# EAGLE design 8_CAN (EAGLE 9.3.0)
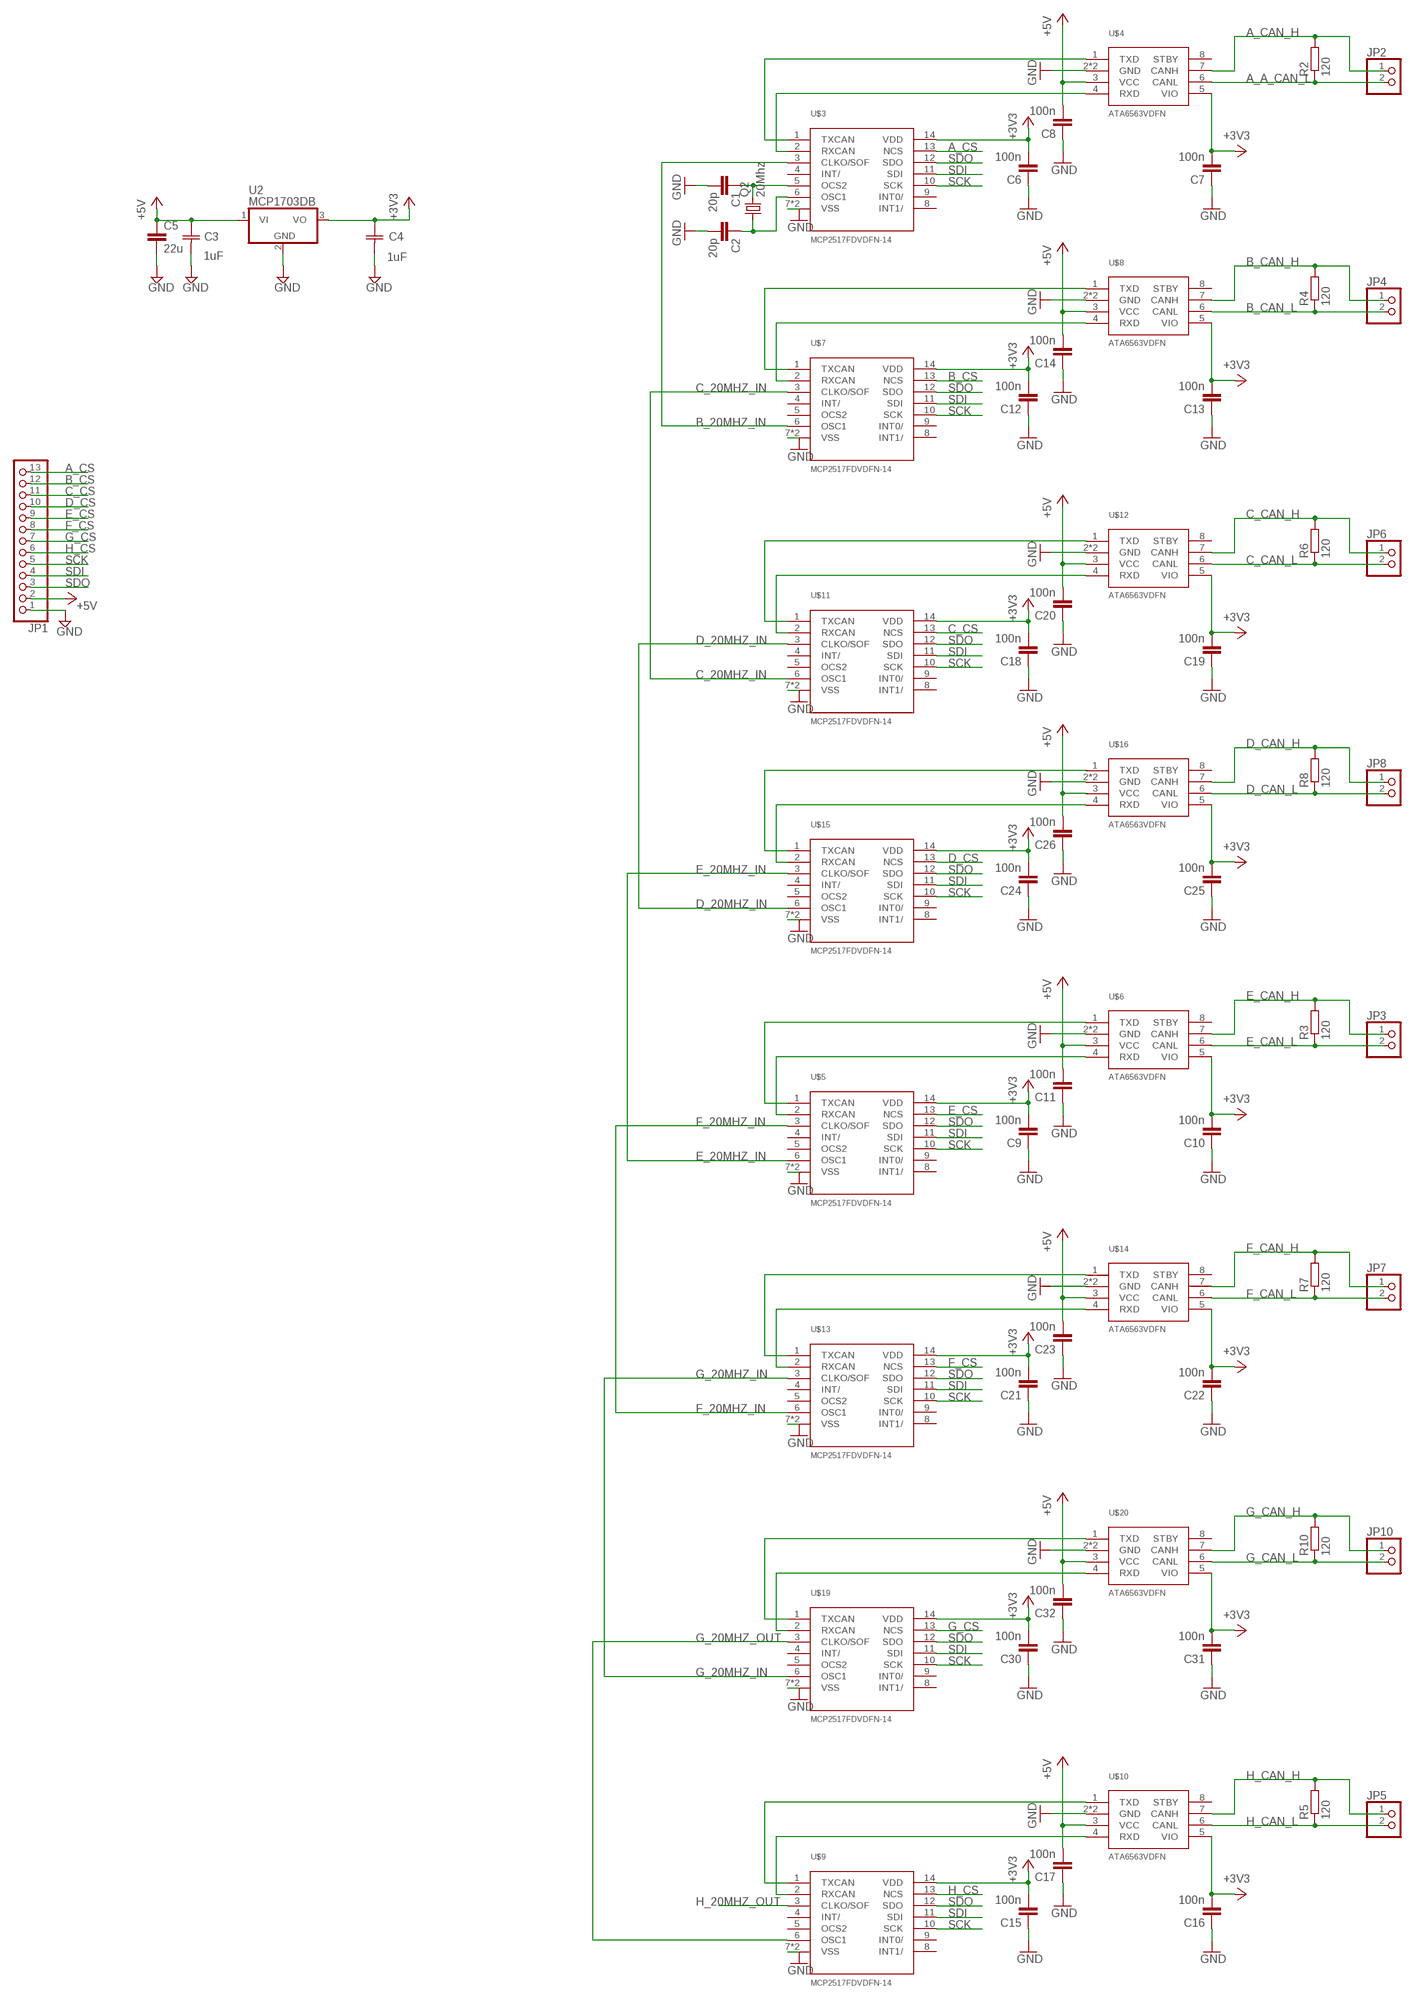
[diagram p0: schematic, sheet 1]

## Parts
C1  20p  C-EUC0402  [C0402]
C2  20p  C-EUC0402  [C0402]
C3  1uF  C0805C105K3RACTU  [CAPC2013X140N]
C4  1uF  C0805C105K3RACTU  [CAPC2013X140N]
C5  22u  C-EUC1206  [C1206]
C6  100n  C-EUC0402  [C0402]
C7  100n  C-EUC0402  [C0402]
C8  100n  C-EUC0402  [C0402]
C9  100n  C-EUC0402  [C0402]
C10  100n  C-EUC0402  [C0402]
C11  100n  C-EUC0402  [C0402]
C12  100n  C-EUC0402  [C0402]
C13  100n  C-EUC0402  [C0402]
C14  100n  C-EUC0402  [C0402]
C15  100n  C-EUC0402  [C0402]
C16  100n  C-EUC0402  [C0402]
C17  100n  C-EUC0402  [C0402]
C18  100n  C-EUC0402  [C0402]
C19  100n  C-EUC0402  [C0402]
C20  100n  C-EUC0402  [C0402]
C21  100n  C-EUC0402  [C0402]
C22  100n  C-EUC0402  [C0402]
C23  100n  C-EUC0402  [C0402]
C24  100n  C-EUC0402  [C0402]
C25  100n  C-EUC0402  [C0402]
C26  100n  C-EUC0402  [C0402]
C30  100n  C-EUC0402  [C0402]
C31  100n  C-EUC0402  [C0402]
C32  100n  C-EUC0402  [C0402]
JP1  PINHD-1X13  [1X13]
JP2  PINHD-1X2  [1X02]
JP3  PINHD-1X2  [1X02]
JP4  PINHD-1X2  [1X02]
JP5  PINHD-1X2  [1X02]
JP6  PINHD-1X2  [1X02]
JP7  PINHD-1X2  [1X02]
JP8  PINHD-1X2  [1X02]
JP10  PINHD-1X2  [1X02]
Q2  20Mhz  CRYSTALCTS406  [CTS406]
R2  120  R-EU_R0402  [R0402]
R3  120  R-EU_R0402  [R0402]
R4  120  R-EU_R0402  [R0402]
R5  120  R-EU_R0402  [R0402]
R6  120  R-EU_R0402  [R0402]
R7  120  R-EU_R0402  [R0402]
R8  120  R-EU_R0402  [R0402]
R10  120  R-EU_R0402  [R0402]
U2  MCP1703DB  [SOT223]
U$3  MCP2517FDVDFN-14  [VDFN-14_4.5X3]
U$4  ATA6563VDFN  [VDFN-8_3X3]
U$5  MCP2517FDVDFN-14  [VDFN-14_4.5X3]
U$6  ATA6563VDFN  [VDFN-8_3X3]
U$7  MCP2517FDVDFN-14  [VDFN-14_4.5X3]
U$8  ATA6563VDFN  [VDFN-8_3X3]
U$9  MCP2517FDVDFN-14  [VDFN-14_4.5X3]
U$10  ATA6563VDFN  [VDFN-8_3X3]
U$11  MCP2517FDVDFN-14  [VDFN-14_4.5X3]
U$12  ATA6563VDFN  [VDFN-8_3X3]
U$13  MCP2517FDVDFN-14  [VDFN-14_4.5X3]
U$14  ATA6563VDFN  [VDFN-8_3X3]
U$15  MCP2517FDVDFN-14  [VDFN-14_4.5X3]
U$16  ATA6563VDFN  [VDFN-8_3X3]
U$19  MCP2517FDVDFN-14  [VDFN-14_4.5X3]
U$20  ATA6563VDFN  [VDFN-8_3X3]

## Nets
+3V3: C4.1(C1) C6.2 C7.2 C9.2 C10.2 C12.2 C13.2 C15.2 C16.2 C18.2 C19.2 C21.2 C22.2 C24.2 C25.2 C30.2 C31.2 U2.3(VO) U$3.14(VDD) U$4.5(VIO) U$5.14(VDD) U$6.5(VIO) U$7.14(VDD) U$8.5(VIO) U$9.14(VDD) U$10.5(VIO) U$11.14(VDD) U$12.5(VIO) U$13.14(VDD) U$14.5(VIO) U$15.14(VDD) U$16.5(VIO) U$19.14(VDD) U$20.5(VIO)
+5V: C3.1(C1) C5.1 C8.2 C11.2 C14.2 C17.2 C20.2 C23.2 C26.2 C32.2 JP1.2 U2.1(VI) U$4.3(VCC) U$6.3(VCC) U$8.3(VCC) U$10.3(VCC) U$12.3(VCC) U$14.3(VCC) U$16.3(VCC) U$20.3(VCC)
A_A_CAN_L: JP2.2 R2.1 U$4.6(CANL)
A_CAN_H: JP2.1 R2.2 U$4.7(CANH)
A_CS: JP1.13 U$3.13(NCS)
B_20MHZ_IN: U$3.3(CLKO/SOF) U$7.6(OSC1)
B_CAN_H: JP4.1 R4.2 U$8.7(CANH)
B_CAN_L: JP4.2 R4.1 U$8.6(CANL)
B_CS: JP1.12 U$7.13(NCS)
C_20MHZ_IN: U$7.3(CLKO/SOF) U$11.6(OSC1)
C_CAN_H: JP6.1 R6.2 U$12.7(CANH)
C_CAN_L: JP6.2 R6.1 U$12.6(CANL)
C_CS: JP1.11 U$11.13(NCS)
D_20MHZ_IN: U$11.3(CLKO/SOF) U$15.6(OSC1)
D_CAN_H: JP8.1 R8.2 U$16.7(CANH)
D_CAN_L: JP8.2 R8.1 U$16.6(CANL)
D_CS: JP1.10 U$15.13(NCS)
E_20MHZ_IN: U$5.6(OSC1) U$15.3(CLKO/SOF)
E_CAN_H: JP3.1 R3.2 U$6.7(CANH)
E_CAN_L: JP3.2 R3.1 U$6.6(CANL)
E_CS: JP1.9 U$5.13(NCS)
F_20MHZ_IN: U$5.3(CLKO/SOF) U$13.6(OSC1)
F_CAN_H: JP7.1 R7.2 U$14.7(CANH)
F_CAN_L: JP7.2 R7.1 U$14.6(CANL)
F_CS: JP1.8 U$13.13(NCS)
G_20MHZ_IN: U$13.3(CLKO/SOF) U$19.6(OSC1)
G_20MHZ_OUT: U$9.6(OSC1) U$19.3(CLKO/SOF)
G_CAN_H: JP10.1 R10.2 U$20.7(CANH)
G_CAN_L: JP10.2 R10.1 U$20.6(CANL)
G_CS: JP1.7 U$19.13(NCS)
GND: C1.2 C2.2 C3.2(C2) C4.2(C2) C5.2 C6.1 C7.1 C8.1 C9.1 C10.1 C11.1 C12.1 C13.1 C14.1 C15.1 C16.1 C17.1 C18.1 C19.1 C20.1 C21.1 C22.1 C23.1 C24.1 C25.1 C26.1 C30.1 C31.1 C32.1 JP1.1 U2.2(GND) U$3.7(VSS) U$3.15(VSS) U$4.2(GND) U$4.9(GND) U$5.7(VSS) U$5.15(VSS) U$6.2(GND) U$6.9(GND) U$7.7(VSS) U$7.15(VSS) U$8.2(GND) U$8.9(GND) U$9.7(VSS) U$9.15(VSS) U$10.2(GND) U$10.9(GND) U$11.7(VSS) U$11.15(VSS) U$12.2(GND) U$12.9(GND) U$13.7(VSS) U$13.15(VSS) U$14.2(GND) U$14.9(GND) U$15.7(VSS) U$15.15(VSS) U$16.2(GND) U$16.9(GND) U$19.7(VSS) U$19.15(VSS) U$20.2(GND) U$20.9(GND)
H_20MHZ_OUT: U$9.3(CLKO/SOF)
H_CAN_H: JP5.1 R5.2 U$10.7(CANH)
H_CAN_L: JP5.2 R5.1 U$10.6(CANL)
H_CS: JP1.6 U$9.13(NCS)
N$1: C1.1 Q2.3 U$3.5(OCS2)
N$2: C2.1 Q2.1 U$3.6(OSC1)
N$3: U$3.1(TXCAN) U$4.1(TXD)
N$4: U$3.2(RXCAN) U$4.4(RXD)
N$5: U$5.1(TXCAN) U$6.1(TXD)
N$6: U$5.2(RXCAN) U$6.4(RXD)
N$7: U$7.1(TXCAN) U$8.1(TXD)
N$8: U$7.2(RXCAN) U$8.4(RXD)
N$9: U$9.1(TXCAN) U$10.1(TXD)
N$10: U$9.2(RXCAN) U$10.4(RXD)
N$11: U$11.1(TXCAN) U$12.1(TXD)
N$12: U$11.2(RXCAN) U$12.4(RXD)
N$13: U$13.1(TXCAN) U$14.1(TXD)
N$14: U$13.2(RXCAN) U$14.4(RXD)
N$15: U$15.1(TXCAN) U$16.1(TXD)
N$16: U$15.2(RXCAN) U$16.4(RXD)
N$19: U$19.1(TXCAN) U$20.1(TXD)
N$20: U$19.2(RXCAN) U$20.4(RXD)
SCK: JP1.5 U$3.10(SCK) U$5.10(SCK) U$7.10(SCK) U$9.10(SCK) U$11.10(SCK) U$13.10(SCK) U$15.10(SCK) U$19.10(SCK)
SDI: JP1.4 U$3.11(SDI) U$5.11(SDI) U$7.11(SDI) U$9.11(SDI) U$11.11(SDI) U$13.11(SDI) U$15.11(SDI) U$19.11(SDI)
SDO: JP1.3 U$3.12(SDO) U$5.12(SDO) U$7.12(SDO) U$9.12(SDO) U$11.12(SDO) U$13.12(SDO) U$15.12(SDO) U$19.12(SDO)
Unconnected: U$3.4(INT/) U$3.8(INT1/) U$3.9(INT0/) U$4.8(STBY) U$5.4(INT/) U$5.5(OCS2) U$5.8(INT1/) U$5.9(INT0/) U$6.8(STBY) U$7.4(INT/) U$7.5(OCS2) U$7.8(INT1/) U$7.9(INT0/) U$8.8(STBY) U$9.4(INT/) U$9.5(OCS2) U$9.8(INT1/) U$9.9(INT0/) U$10.8(STBY) U$11.4(INT/) U$11.5(OCS2) U$11.8(INT1/) U$11.9(INT0/) U$12.8(STBY) U$13.4(INT/) U$13.5(OCS2) U$13.8(INT1/) U$13.9(INT0/) U$14.8(STBY) U$15.4(INT/) U$15.5(OCS2) U$15.8(INT1/) U$15.9(INT0/) U$16.8(STBY) U$19.4(INT/) U$19.5(OCS2) U$19.8(INT1/) U$19.9(INT0/) U$20.8(STBY)

## Library data of the parts
C1 C2 C6-C26 C30-C32 = resistor:C-EU: CAPACITOR, European symbol
C3 C4 = Kemet_By_element14_Batch_1:C0805C105K3RACTU: CAPACITOR, 0805; MPN: C0805C105K3RACTU; OC_FARNELL: 1637035; OC_NEWARK: 93K6001; SUPPLIER: Kemet; TOLERANCE: ±10%; VOLTAGERATING: 25V
C5 = rcl:C-EU: CAPACITOR, European symbol; SPICEPREFIX: C
JP1 = pinhead:PINHD-1X13: PIN HEADER
JP2-JP8 JP10 = pinhead:PINHD-1X2: PIN HEADER
Q2 = crystal:CRYSTAL: CRYSTAL; OC_FARNELL: unknown; OC_NEWARK: unknown
R2-R8 R10 = resistor:R-EU_: RESISTOR, European symbol
U2 = linear:MCP1703: 250 mA, 16V, Low Quiescent Current LDO Regulator Source: http://ww1.microchip.com/downloads/en/DeviceDoc/22049b.pdf
U$3 U$5 U$7 U$9 U$11 U$13 U$15 U$19 = mcp2517fd:MCP2517FD
U$4 U$6 U$8 U$10 U$12 U$14 U$16 U$20 = ATA6563:ATA6563

## Board
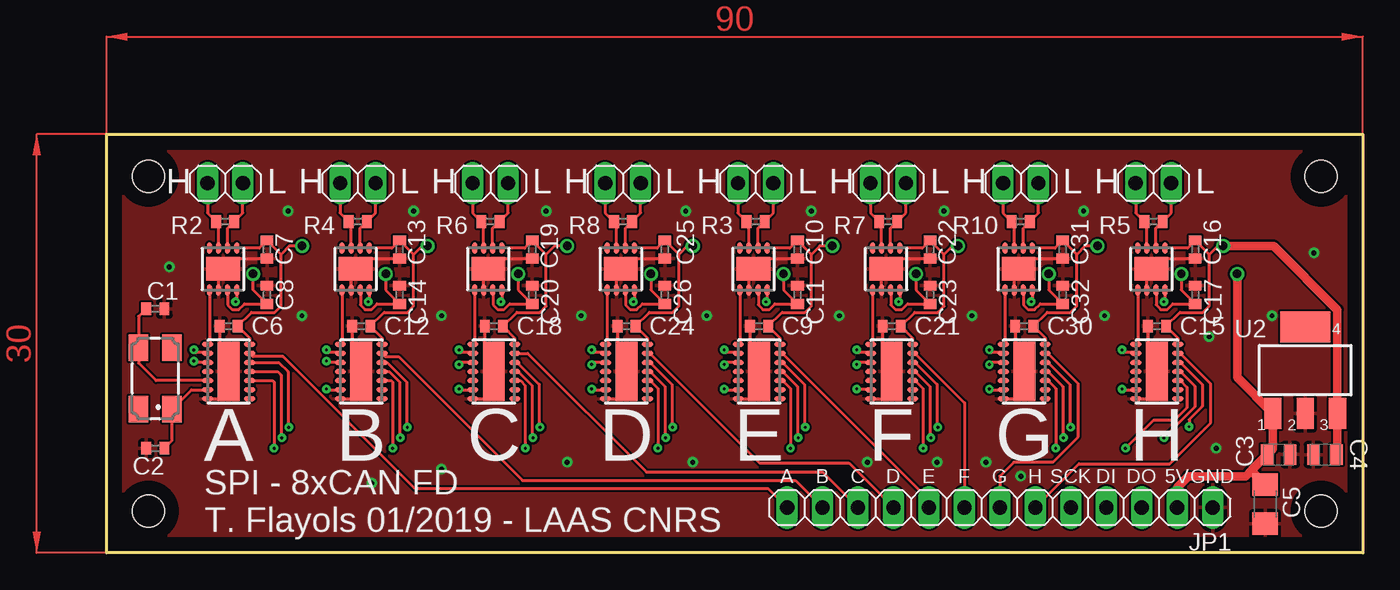
[diagram p1: board, top side]
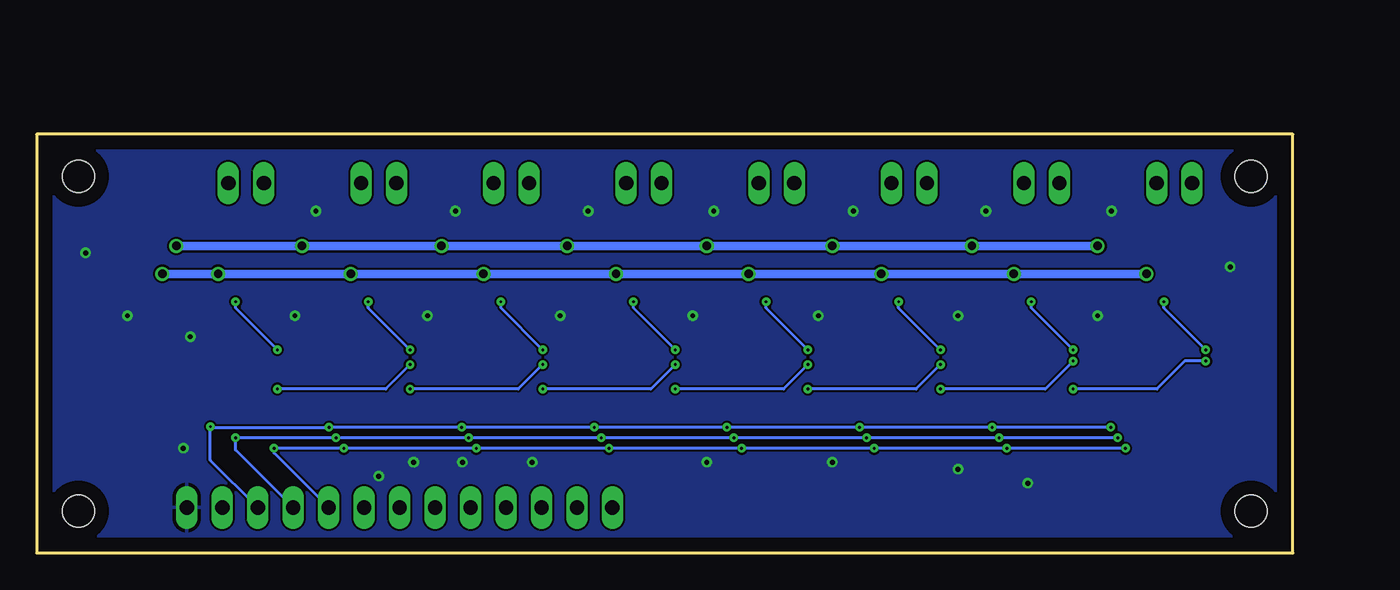
[diagram p2: board, bottom side, seen from below]

Size 90 x 30 mm. Coordinates in mm from the lower left corner, seen from the top.
Outline: 0,30 90,30 90,0 0,0 0,30
Copper layers (1*16): Top 0.035mm / dielectric 1.5mm / Bottom 0.035mm
Design rules "default": minimum track width 6mil, minimum drill 0.35mm, track to track 6mil, track to pad 6mil, pad to pad 6mil, via to via 6mil, smd to smd 6mil, copper to edge 40mil, drill to drill 6mil, minimum pad ring 10mil, minimum via ring 8mil, stop-mask expansion 4mil, vias tented up to drill 0mil, thermal gap 10mil
Holes 2.3 mm at 3,3 3,27 87,3 87,27

### Footprints (pad centres in the part's own frame; a part is rotated, then mirrored left to right if it is on the bottom)
C0402 = smd 0.7 x 0.9: 1 -0.65,0; 2 0.65,0
CAPC2013X140N = smd 0.914 x 1.448: 1 -0.813,0; 2 0.813,0
C1206 = smd 1.6 x 1.8: 1 -1.4,0; 2 1.4,0
1X13 = drill 1.016 long: 1 -15.24,0; 2 -12.7,0; 3 -10.16,0; 4 -7.62,0; 5 -5.08,0; 6 -2.54,0; 7 0,0; 8 2.54,0; 9 5.08,0; 10 7.62,0; 11 10.16,0; 12 12.7,0; 13 15.24,0
1X02 = drill 1.016 long: 1 -1.27,0; 2 1.27,0
CTS406 = smd 1.9 x 1.4: 1 -2.2,-1.2; 2 2.2,-1.2; 3 2.2,1.2; 4 -2.2,1.2
R0402 = smd 0.7 x 0.9: 1 -0.65,0; 2 0.65,0
SOT223 = smd 1.219 x 2.235: 1 -2.311,-3.099; 2 0,-3.099; 3 2.311,-3.099 | smd 3.6 x 2.2: 4 0,3.099
VDFN-14_4.5X3 = smd 0.8 x 0.35: 1 -1.5,1.95; 2 -1.5,1.3; 3 -1.5,0.65; 4 -1.5,0; 5 -1.5,-0.65; 6 -1.5,-1.3; 7 -1.5,-1.95; 8 1.5,-1.95; 9 1.5,-1.3; 10 1.5,-0.65; 11 1.5,0; 12 1.5,0.65; 13 1.5,1.3; 14 1.5,1.95 | smd 1.65 x 4.25: 15 0,0
VDFN-8_3X3 = smd 0.8 x 0.35: 1 -1.5,0.975; 2 -1.5,0.325; 3 -1.5,-0.325; 4 -1.5,-0.975; 5 1.5,-0.975; 6 1.5,-0.325; 7 1.5,0.325; 8 1.5,0.975 | smd 1.7 x 2.5: 9 0,0

### Placement (x,y rotation side)
C1  3.5,17.5 0 top
C2  3.5,7.5 180 top
C3  83.97,7.05 0 top
C4  87.28,7.04 180 top
C5  83,3.5 270 top
C6  8.75,16.25 0 top
C7  11.5,21.75 90 top
C8  11.5,18.5 270 top
C9  46.75,16.25 0 top
C10  49.5,21.75 90 top
C11  49.5,18.5 270 top
C12  18.25,16.25 0 top
C13  21,21.75 90 top
C14  21,18.5 270 top
C15  75.25,16.25 0 top
C16  78,21.75 90 top
C17  78,18.5 270 top
C18  27.75,16.25 0 top
C19  30.5,21.75 90 top
C20  30.5,18.5 270 top
C21  56.25,16.25 0 top
C22  59,21.75 90 top
C23  59,18.5 270 top
C24  37.25,16.25 0 top
C25  40,21.75 90 top
C26  40,18.5 270 top
C30  65.75,16.25 0 top
C31  68.5,21.75 90 top
C32  68.5,18.5 270 top
JP1  64,3.25 180 top
JP2  8.5,26.5 0 top
JP3  46.5,26.5 0 top
JP4  18,26.5 0 top
JP5  75,26.5 0 top
JP6  27.5,26.5 0 top
JP7  56,26.5 0 top
JP8  37,26.5 0 top
JP10  65.5,26.5 0 top
Q2  3.5,12.5 90 top
R2  8.5,23.75 180 top
R3  46.5,23.75 180 top
R4  18,23.75 180 top
R5  75,23.75 180 top
R6  27.5,23.75 180 top
R7  56,23.75 180 top
R8  37,23.75 180 top
R10  65.5,23.75 180 top
U2  85.88,13.09 0 top
U$3  8.75,13 0 top
U$4  8.35,20.35 90 top
U$5  46.75,13 0 top
U$6  46.35,20.35 90 top
U$7  18.25,13 0 top
U$8  17.85,20.35 90 top
U$9  75.25,13 0 top
U$10  74.85,20.35 90 top
U$11  27.75,13 0 top
U$12  27.35,20.35 90 top
U$13  56.25,13 0 top
U$14  55.85,20.35 90 top
U$15  37.25,13 0 top
U$16  36.85,20.35 90 top
U$19  65.75,13 0 top
U$20  65.35,20.35 90 top

### Tracks (layer width: path | path; a pad name or v marks a point on that pad's centre or on a via)
+3V3  (via drill 0.6)
  Top 0.2: U$4.5 10.95,21.85 C7.2 12.5,21.4 | U$3.14 10.25,15.4 C6.2 10.4,17.25 12.05,17.25 12.5,17.69 12.5,21.4 | U$8.5 20.45,21.85 C13.2 22,21.4 | U$7.14 19.75,15.4 C12.2 19.9,17.25 21.55,17.25 22,17.69 22,21.4 | U$12.5 29.95,21.85 C19.2 31.5,21.4 | U$11.14 29.25,15.4 C18.2 29.4,17.25 31.05,17.25 31.5,17.69 31.5,21.4 | U$16.5 39.45,21.85 C25.2 41,21.4 | U$15.14 38.75,15.4 C24.2 38.9,17.25 40.55,17.25 41,17.69 41,21.4 | U$6.5 48.95,21.85 C10.2 50.5,21.4 | U$5.14 48.25,15.4 C9.2 48.4,17.25 50.05,17.25 50.5,17.69 50.5,21.4 | U$14.5 58.45,21.85 C22.2 60,21.4 | U$13.14 57.75,15.4 C21.2 57.9,17.25 59.55,17.25 60,17.69 60,21.4 | U$20.5 67.95,21.85 C31.2 69.5,21.4 | U$19.14 67.25,15.4 C30.2 67.4,17.25 69.06,17.25 69.5,17.69 69.5,21.4 | U$10.5 77.45,21.85 C16.2 79,21.4 | U$9.14 76.75,15.4 C15.2 76.9,17.25 78.56,17.25 79,17.69 79,21.4 | v14,22 13.1,22 12.5,21.4 | v23,22 22.6,22 22,21.4 | v33,22 32.1,22 31.5,21.4 | v42,22 41.6,22 41,21.4 | v52,22 51.1,22 50.5,21.4 | v61,22 60.6,22 60,21.4 | v71,22 70.1,22 69.5,21.4 | v80,22 79.6,22 79,21.4
  Top 0.61: C4.1 88.19,7.14 U2.3 88.19,17.43 83.62,22 v80,22
  Bottom 0.61: v80,22 v71,22 v61,22 v52,22 v42,22 v33,22 v23,22 v14,22
+5V  (via drill 0.6)
  Top 0.2: U$4.3 8.69,18.83 8.69,17.77 9.02,17.44 9.48,17.44 9.89,17.85 C8.2 10.5,18.85 v10.5,20 | U$8.3 18.19,18.83 18.19,17.77 18.52,17.44 18.98,17.44 19.39,17.85 C14.2 20,18.85 v20,20 | U$12.3 27.69,18.83 27.69,17.77 28.02,17.44 28.48,17.44 28.89,17.85 C20.2 29.5,18.85 v29.5,20 | U$16.3 37.19,18.83 37.19,17.77 37.52,17.44 37.98,17.44 38.39,17.85 C26.2 39,18.85 v39,20 | U$6.3 46.69,18.83 46.69,17.77 47.02,17.44 47.48,17.44 47.89,17.85 C11.2 48.5,18.85 v48.5,20 | U$14.3 56.19,18.83 56.19,17.77 56.52,17.44 56.98,17.44 57.39,17.85 C23.2 58,18.85 v58,20 | U$20.3 65.69,18.83 65.69,17.77 66.02,17.44 66.48,17.44 66.89,17.85 C32.2 67.5,18.85 v67.5,20 | U$10.3 75.19,18.83 75.19,17.77 75.52,17.44 75.98,17.44 76.39,17.85 C17.2 77,18.85 v77,20
  Top 0.61: v81,20 81,12.56 U2.1 83.57,7.46 C3.1 82.06,5.95 | JP1.2 76.7,4.7 77.5,5.5 81.61,5.5 82.06,5.95 | C5.1 82.06,5.84 82.06,5.95
  Bottom 0.61: v10.5,20 v20,20 v29.5,20 v39,20 v48.5,20 v58,20 v67.5,20 v77,20 v81,20
A_A_CAN_L
  Top 0.2: U$4.6 8.68,23.27 R2.1 9.77,24.37 JP2.2
A_CAN_H
  Top 0.2: U$4.7 8.03,23.57 R2.2 7.23,24.37 JP2.1
A_CS
  Top 0.2: U$3.13 10.47,14.08 12.64,14.08 22.12,4.59 47.42,4.59 JP1.13
B_20MHZ_IN  (via drill 0.2)
  Top 0.2: U$3.3 6.35,13.65 v6.25,13.75 | v15.75,11.75 15.8,11.7 U$7.6
  Bottom 0.2: v6.25,13.75 7.75,13.75 9.75,11.75 v15.75,11.75
B_CAN_H
  Top 0.2: U$8.7 17.52,23.57 R4.2 16.73,24.37 JP4.1
B_CAN_L
  Top 0.2: U$8.6 18.18,23.27 R4.1 19.27,24.37 JP4.2
B_CS
  Top 0.2: U$7.13 19.97,14.08 20.92,14.08 29.8,5.2 49.35,5.2 JP1.12
C_20MHZ_IN  (via drill 0.2)
  Top 0.2: U$7.3 15.85,13.65 v15.75,13.75 | v25.25,11.75 25.3,11.7 U$11.6
  Bottom 0.2: v15.75,13.75 17.75,11.75 v25.25,11.75
C_CAN_H
  Top 0.2: U$12.7 27.02,23.57 R6.2 26.23,24.37 JP6.1
C_CAN_L
  Top 0.2: U$12.6 27.68,23.27 R6.1 28.77,24.37 JP6.2
C_CS
  Top 0.2: JP1.11 51.29,5.8 38.67,5.8 30.18,14.3 U$11.13
D_20MHZ_IN  (via drill 0.2)
  Top 0.2: U$11.3 25.4,13.65 v25.25,13.5 | v34.75,11.75 34.8,11.7 U$15.6
  Bottom 0.2: v25.25,13.5 27,11.75 v34.75,11.75
D_CAN_H
  Top 0.2: U$16.7 36.52,23.57 R8.2 35.73,24.37 JP8.1
D_CAN_L
  Top 0.2: U$16.6 37.17,23.27 R8.1 38.27,24.37 JP8.2
D_CS
  Top 0.2: JP1.10 53.19,6.44 46.78,6.44 38.93,14.3 U$15.13
E_20MHZ_IN  (via drill 0.2)
  Top 0.2: U$15.3 34.9,13.65 v34.75,13.5 | v44.25,11.75 44.3,11.7 U$5.6
  Bottom 0.2: v34.75,13.5 36.5,11.75 v44.25,11.75
E_CAN_H
  Top 0.2: U$6.7 46.02,23.57 R3.2 45.23,24.37 JP3.1
E_CAN_L
  Top 0.2: U$6.6 46.67,23.27 R3.1 47.77,24.37 JP3.2
E_CS
  Top 0.2: JP1.9 58.92,3.81 48.43,14.3 U$5.13
F_20MHZ_IN  (via drill 0.2)
  Top 0.2: U$5.3 44.4,13.65 v44.25,13.5 | v53.75,11.75 54.7,11.75 U$13.6
  Bottom 0.2: v44.25,13.5 46,11.75 v53.75,11.75
F_CAN_H
  Top 0.2: U$14.7 55.52,23.57 R7.2 54.73,24.37 JP7.1
F_CAN_L
  Top 0.2: U$14.6 56.17,23.27 R7.1 57.27,24.37 JP7.2
F_CS
  Top 0.2: JP1.8 61.46,10.77 57.93,14.3 U$13.13
G_20MHZ_IN  (via drill 0.2)
  Top 0.2: U$13.3 53.9,13.65 v53.75,13.5 | v63.25,11.75 63.3,11.7 U$19.6
  Bottom 0.2: v53.75,13.5 55.5,11.75 v63.25,11.75
G_20MHZ_OUT  (via drill 0.2)
  Top 0.2: U$19.3 63.4,13.65 v63.25,13.5 | v72.75,11.75 72.8,11.7 U$9.6
  Bottom 0.2: v63.25,13.5 65,11.75 v72.75,11.75
G_CAN_H
  Top 0.2: U$20.7 65.03,23.57 R10.2 64.23,24.37 JP10.1
G_CAN_L
  Top 0.2: U$20.6 65.67,23.27 R10.1 66.77,24.37 JP10.2
G_CS
  Top 0.2: JP1.7 64,5.5 65,6.5 67.79,6.5 69.61,8.32 69.61,12.12 67.43,14.3 U$19.13
GND  (via drill 0.35)
  Top 0.2: U$4.2 8.03,20.02 U$4.9 9.1,21.1 C7.1 | U$3.7 8.45,11.05 8.5,11 8.75,11.25 U$3.15 | U$8.2 17.52,20.02 U$8.9 18.6,21.1 C13.1 | U$7.7 17.95,11.05 18,11 18.25,11.25 U$7.15 17.6,13.65 C12.1 | U$12.2 27.02,20.02 U$12.9 28.1,21.1 C19.1 | U$11.7 27.45,11.05 27.5,11 27.75,11.25 U$11.15 27.1,13.65 C18.1 | U$16.2 36.52,20.02 U$16.9 37.6,21.1 C25.1 | U$15.7 36.95,11.05 37,11 37.25,11.25 U$15.15 36.6,13.65 C24.1 | U$6.2 46.02,20.02 U$6.9 47.1,21.1 C10.1 | U$5.7 46.45,11.05 46.5,11 46.75,11.25 U$5.15 46.1,13.65 C9.1 | U$14.2 55.52,20.02 U$14.9 56.6,21.1 C22.1 | U$13.7 55.95,11.05 56,11 56.25,11.25 U$13.15 55.6,13.65 C21.1 | U$20.2 65.03,20.02 U$20.9 66.1,21.1 C31.1 | U$19.7 65.45,11.05 65.5,11 65.75,11.25 U$19.15 65.1,13.65 C30.1 | U$10.2 74.53,20.02 U$10.9 75.6,21.1 C16.1 | U$9.7 74.95,11.05 75,11 75.25,11.25 U$9.15 74.6,13.65 C15.1 | C6.1 8.1,14.9 9,14
  other vias: 14,17 24,17 34,17 43,17 52.5,17 62,17 71.5,17 83.5,17 79,15.5 86.5,21.5 70,24.5 60,24.5 50.5,24.5 41.5,24.5 31.5,24.5 22,24.5 13,24.5 4.5,20.5 19,5 24,6 33,6.5 42,6.5 54.5,6.5 59.5,6.5 63,6.5 65.5,5.5 79.5,7.5
  pour Top: 0,30 90,30 90,0 0,0
  pour Bottom: 0,30 0,0 90,0 90,30
H_CAN_H
  Top 0.2: U$10.7 74.53,23.57 R5.2 73.73,24.37 JP5.1
H_CAN_L
  Top 0.2: U$10.6 75.17,23.27 R5.1 76.27,24.37 JP5.2
H_CS
  Top 0.2: JP1.6 69.68,6.39 76.17,6.39 79.11,9.32 79.11,12.12 76.93,14.3 U$9.13
N$1
  Top 0.2: C1.1 2.3,16.95 Q2.3 2.3,13.6 3.55,12.35 U$3.5
N$2
  Top 0.2: C2.1 4.7,8.05 Q2.1 6.1,11.7 U$3.6
N$3
  Top 0.2: U$4.1 7.38,15.07 U$3.1
N$4  (via drill 0.2)
  Top 0.2: U$4.4 9.32,18.07 v9.25,18 | U$3.2 7.1,14.3 7.05,14.35 6.4,14.35 6.25,14.5 v6.25,14.56
  Bottom 0.2: v6.25,14.56 9.25,17.56 v9.25,18
N$5
  Top 0.2: U$6.1 45.38,15.07 U$5.1
N$6  (via drill 0.2)
  Top 0.2: U$6.4 47.33,18.07 v47.25,18 | U$5.2 45.1,14.3 45.05,14.35 44.4,14.35 44.25,14.5 v44.25,14.56
  Bottom 0.2: v44.25,14.56 47.25,17.56 v47.25,18
N$7
  Top 0.2: U$8.1 16.88,15.07 U$7.1
N$8  (via drill 0.2)
  Top 0.2: U$8.4 18.82,18.07 v18.75,18 | U$7.2 16.6,14.3 16.55,14.35 15.9,14.35 15.75,14.5 v15.75,14.56
  Bottom 0.2: v15.75,14.56 18.75,17.56 v18.75,18
N$9
  Top 0.2: U$10.1 73.88,15.07 U$9.1
N$10  (via drill 0.2)
  Top 0.2: U$10.4 75.83,18.07 v75.75,18 | U$9.2 73.6,14.3 73.55,14.35 72.9,14.35 72.75,14.5 v72.75,14.56
  Bottom 0.2: v72.75,14.56 75.75,17.56 v75.75,18
N$11
  Top 0.2: U$12.1 26.38,15.07 U$11.1
N$12  (via drill 0.2)
  Top 0.2: U$12.4 28.32,18.07 v28.25,18 | U$11.2 26.1,14.3 26.05,14.35 25.4,14.35 25.25,14.5 v25.25,14.56
  Bottom 0.2: v25.25,14.56 28.25,17.56 v28.25,18
N$13
  Top 0.2: U$14.1 54.88,15.07 U$13.1
N$14  (via drill 0.2)
  Top 0.2: U$14.4 56.83,18.07 v56.75,18 | U$13.2 54.6,14.3 54.55,14.35 53.9,14.35 53.75,14.5 v53.75,14.56
  Bottom 0.2: v53.75,14.56 56.75,17.56 v56.75,18
N$15
  Top 0.2: U$16.1 35.88,15.07 U$15.1
N$16  (via drill 0.2)
  Top 0.2: U$16.4 37.83,18.07 v37.75,18 | U$15.2 35.6,14.3 35.55,14.35 34.9,14.35 34.75,14.5 v34.75,14.56
  Bottom 0.2: v34.75,14.56 37.75,17.56 v37.75,18
N$19
  Top 0.2: U$20.1 64.38,15.07 U$19.1
N$20  (via drill 0.2)
  Top 0.2: U$20.4 66.33,18.07 v66.25,18 | U$19.2 64.1,14.3 64.05,14.35 63.4,14.35 63.25,14.5 v63.25,14.56
  Bottom 0.2: v63.25,14.56 66.25,17.56 v66.25,18
SCK  (via drill 0.2)
  Top 0.2: U$3.10 11.9,12.35 12,12.25 v12,7.5 | U$7.10 20.4,12.35 20.5,12.25 v20.5,7.5 | U$11.10 29.65,12.35 30,12 v30,7.5 | v39.5,7.5 39.5,11.78 38.93,12.35 U$15.10 | v49,7.5 49,11.78 48.43,12.35 U$5.10 | v58.5,7.5 58.5,11.78 57.93,12.35 U$13.10 | v68,7.5 68,11.78 67.43,12.35 U$19.10 | v73,7.5 75,9.5 76.5,9.5 77.4,10.4 77.4,11.88 76.93,12.35 U$9.10
  Bottom 0.2: v12,7.5 v20.5,7.5 v30,7.5 v39.5,7.5 v49,7.5 v58.5,7.5 v68,7.5 v73,7.5 73,7.17 JP1.5
SDI  (via drill 0.2)
  Top 0.2: U$3.11 12.25,13 12.5,12.75 12.5,8.31 v12.56,8.25 | v30.56,8.25 30.5,8.25 30.5,12 29.5,13 U$11.11 | v40.06,8.25 40,8.25 40,11.93 38.93,13 U$15.11 | v49.56,8.25 49.5,8.25 49.5,11.93 48.43,13 U$5.11 | v59.06,8.25 59,8.25 59,11.93 57.93,13 U$13.11 | v68.56,8.25 68.5,8.25 68.5,11.93 67.43,13 U$19.11 | v75.75,8.25 77.97,10.46 77.97,11.96 76.93,13 U$9.11 | U$7.11 20.25,13 21,12.25 21,8.31 v21.06,8.25
  Bottom 0.2: v12.56,8.25 v21.06,8.25 v30.56,8.25 v40.06,8.25 v49.56,8.25 v59.06,8.25 v68.56,8.25 v75.75,8.25 75.75,7.38 JP1.4
SDO  (via drill 0.2)
  Top 0.2: U$3.12 12.35,13.65 13,13 13,9.06 v13.06,9 | v31.06,9 31,9 31,12.08 29.43,13.65 U$11.12 | v40.56,9 40.5,9 40.5,12.08 38.93,13.65 U$15.12 | v50.06,9 50,9 50,12.08 48.43,13.65 U$5.12 | v59.56,9 59.5,9 59.5,12.08 57.93,13.65 U$13.12 | v69.06,9 69,9 69,12.08 67.43,13.65 U$19.12 | v77.56,9.06 77.56,9.56 78.5,10.5 78.5,12.08 76.93,13.65 U$9.12 | U$7.12 20.1,13.65 21.5,12.25 21.5,9.06 v21.56,9
  Bottom 0.2: v13.06,9 v21.56,9 v31.06,9 v40.56,9 v50.06,9 v59.56,9 v69.06,9 77.5,9 v77.56,9.06 77.56,6.65 JP1.3
(copper drawn outside any net)
  shapes: Top area x2

### Text on the board
tNames: H | L | H | L | H | L | H | L | H | L | H | L | H | L | H | L | A | B | C | D | E | F | G | H | A | B | C | D | E | F | G | H | SCK | DI | DO | 5V | GND | SPI - 8xCAN FD / T. Flayols 01/2019 - LAAS CNRS